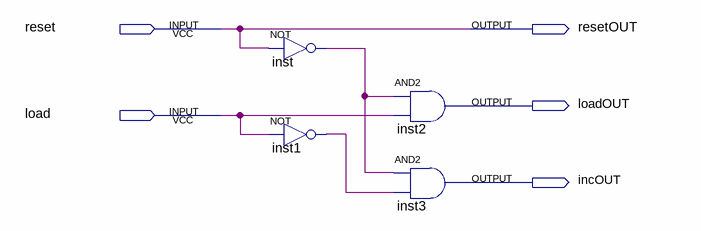
[diagram p0: schematic sheet]
// Quartus schematic PC_input.bdf as structural Verilog: 4 symbols, 5 pins
module PC_input (
  input  reset,
  input  load,
  output resetOUT,
  output loadOUT,
  output incOUT
);

  wire inst1_out, inst_out;

  not inst (inst_out, reset);
  not inst1 (inst1_out, load);
  and inst2 (loadOUT, inst_out, load);
  and inst3 (incOUT, inst_out, inst1_out);

  assign resetOUT = reset;
endmodule
